# Altium schematic sheet fraction layer.SchDoc
size A
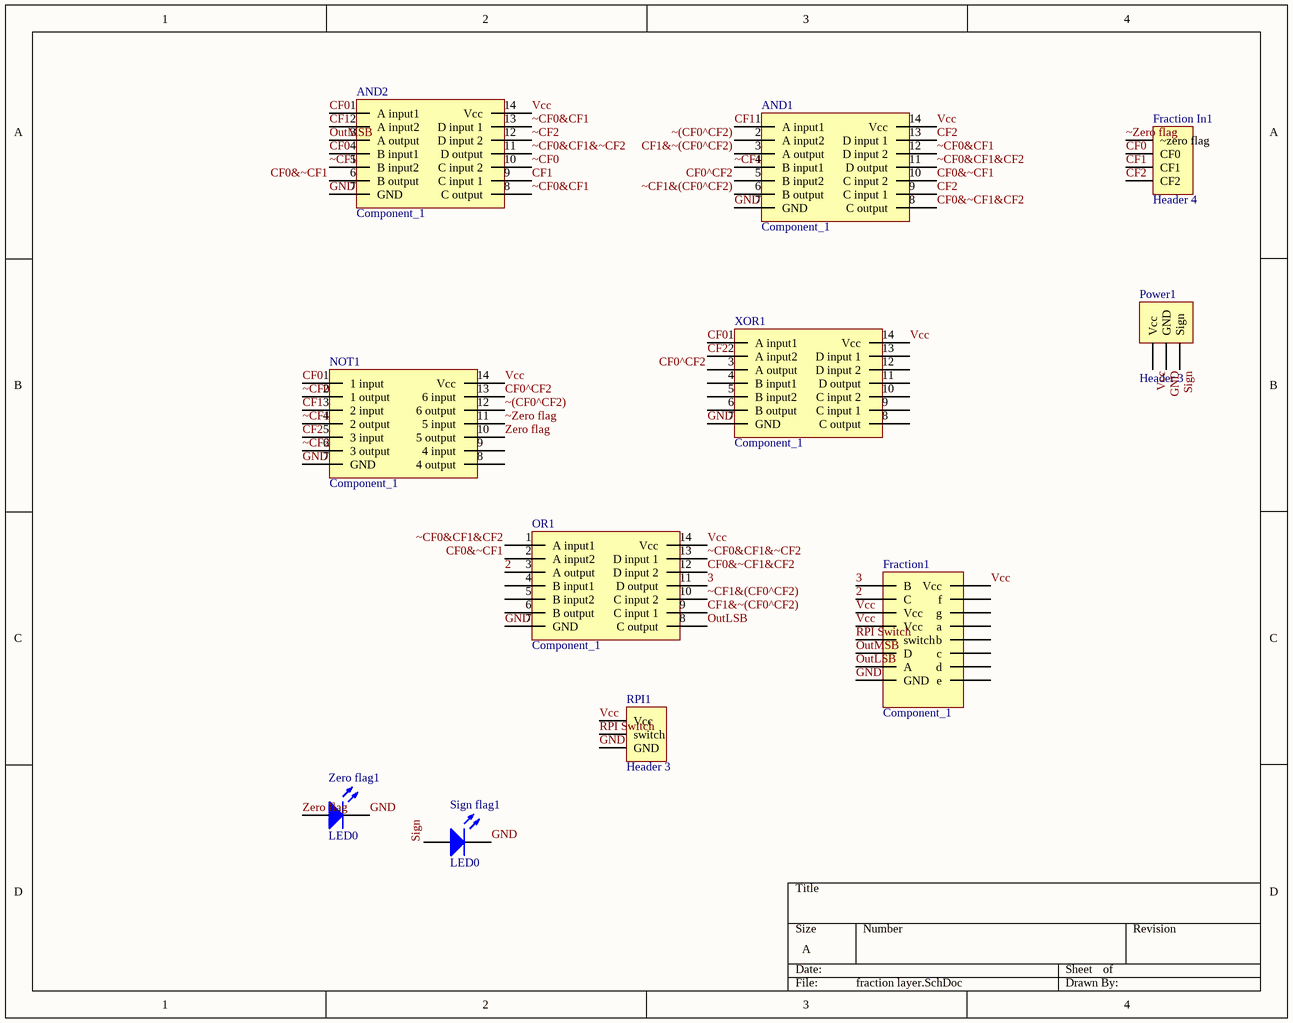
[diagram p0: fraction layer.SchDoc]

## Parts
AND1  Component_1  [Gate?]
AND2  Component_1  [Gate?]
Fraction1  Component_1  [7483]
Fraction_In1  Header 4  [HDR1X4]
NOT1  Component_1  [Gate?]
OR1  Component_1  [Gate?]
Power1  Header 3  [HDR1X3]
RPI1  Header 3  [HDR1X3]
Sign_flag1  LED0  [LED-0]
XOR1  Component_1  [Gate?]
Zero_flag1  LED0  [LED-0]

## Nets
2: Fraction1.C3(C) OR1.3(A_output)
3: Fraction1.A4(B) OR1.11(D_output)
CF0: AND2.1(A_input1) AND2.4(B_input1) Fraction_In1.2(CF0) NOT1.1(1_input) XOR1.1(A_input1)
CF0&~CF1: AND1.10(C_input_2) AND2.6(B_output) OR1.2(A_input2)
CF0&~CF1&CF2: AND1.8(C_output) OR1.12(D_input_2)
CF0^CF2: AND1.5(B_input2) NOT1.13(6_input) XOR1.3(A_output)
CF1: AND1.1(A_input1) AND2.2(A_input2) AND2.9(C_input_1) Fraction_In1.3(CF1) NOT1.3(2_input)
CF1&~(CF0^CF2): AND1.3(A_output) OR1.9(C_input_1)
CF2: AND1.9(C_input_1) AND1.13(D_input_1) Fraction_In1.4(CF2) NOT1.5(3_input) XOR1.2(A_input2)
GND: AND1.7(GND) AND2.7(GND) Fraction1.A2(GND) NOT1.7(GND) OR1.7(GND) Power1.2(GND) RPI1.3(GND) Sign_flag1.2(K) XOR1.7(GND) Zero_flag1.2(K)
OutLSB: Fraction1.B2(A) OR1.8(C_output)
OutMSB: AND2.3(A_output) Fraction1.C2(D)
RPI Switch: Fraction1.Vcc(switch) RPI1.2(switch)
Sign: Power1.3(Sign) Sign_flag1.1(A)
Vcc: AND1.14(Vcc) AND2.14(Vcc) Fraction1.A3(Vcc) Fraction1.B3(Vcc) Fraction1.B4(Vcc) NOT1.14(Vcc) OR1.14(Vcc) Power1.1(Vcc) RPI1.1(Vcc) XOR1.14(Vcc)
Zero flag: NOT1.10(5_output) Zero_flag1.1(A)
~(CF0^CF2): AND1.2(A_input2) NOT1.12(6_output)
~CF0: AND2.10(C_input_2) NOT1.2(1_output)
~CF0&CF1: AND1.12(D_input_2) AND2.8(C_output) AND2.13(D_input_1)
~CF0&CF1&CF2: AND1.11(D_output) OR1.1(A_input1)
~CF0&CF1&~CF2: AND2.11(D_output) OR1.13(D_input_1)
~CF1: AND1.4(B_input1) AND2.5(B_input2) NOT1.4(2_output)
~CF1&(CF0^CF2): AND1.6(B_output) OR1.10(C_input_2)
~CF2: AND2.12(D_input_2) NOT1.6(3_output)
~Zero flag: Fraction_In1.1(~zero_flag) NOT1.11(5_input)

Not connected (* = marked no-connect by the designer): Fraction1 A1(d) B1(c) C0(a) C1(e) C4(f) C5(g) GND(b); NOT1 8(4_output) 9(4_input); OR1 4(B_input1) 5(B_input2) 6(B_output); XOR1 4(B_input1) 5(B_input2) 6(B_output) 8(C_output) 9(C_input_1) 10(C_input_2) 11(D_output) 12(D_input_2) 13(D_input_1)

## Library data of the parts
Fraction_In1 = Header 4: Header, 4-Pin; LatestRevisionDate: 17-Jul-2002; LatestRevisionNote: Re-released for DXP Platform.; Publisher: Altium Limited
Power1 RPI1 = Header 3: Header, 3-Pin; LatestRevisionDate: 17-Jul-2002; LatestRevisionNote: Re-released for DXP Platform.; Publisher: Altium Limited
Sign_flag1 Zero_flag1 = LED0: Typical INFRARED GaAs LED; Published: 8-Jun-2000; LatestRevisionDate: 08-Jul-2005; LatestRevisionNote: Mech Layer 1 removed.; PackageReference: LED-0; Publisher: Altium Limited; PackageDescription: LED; 2 Leads